# Altium schematic sheet ZMBo Main.SchDoc
size B
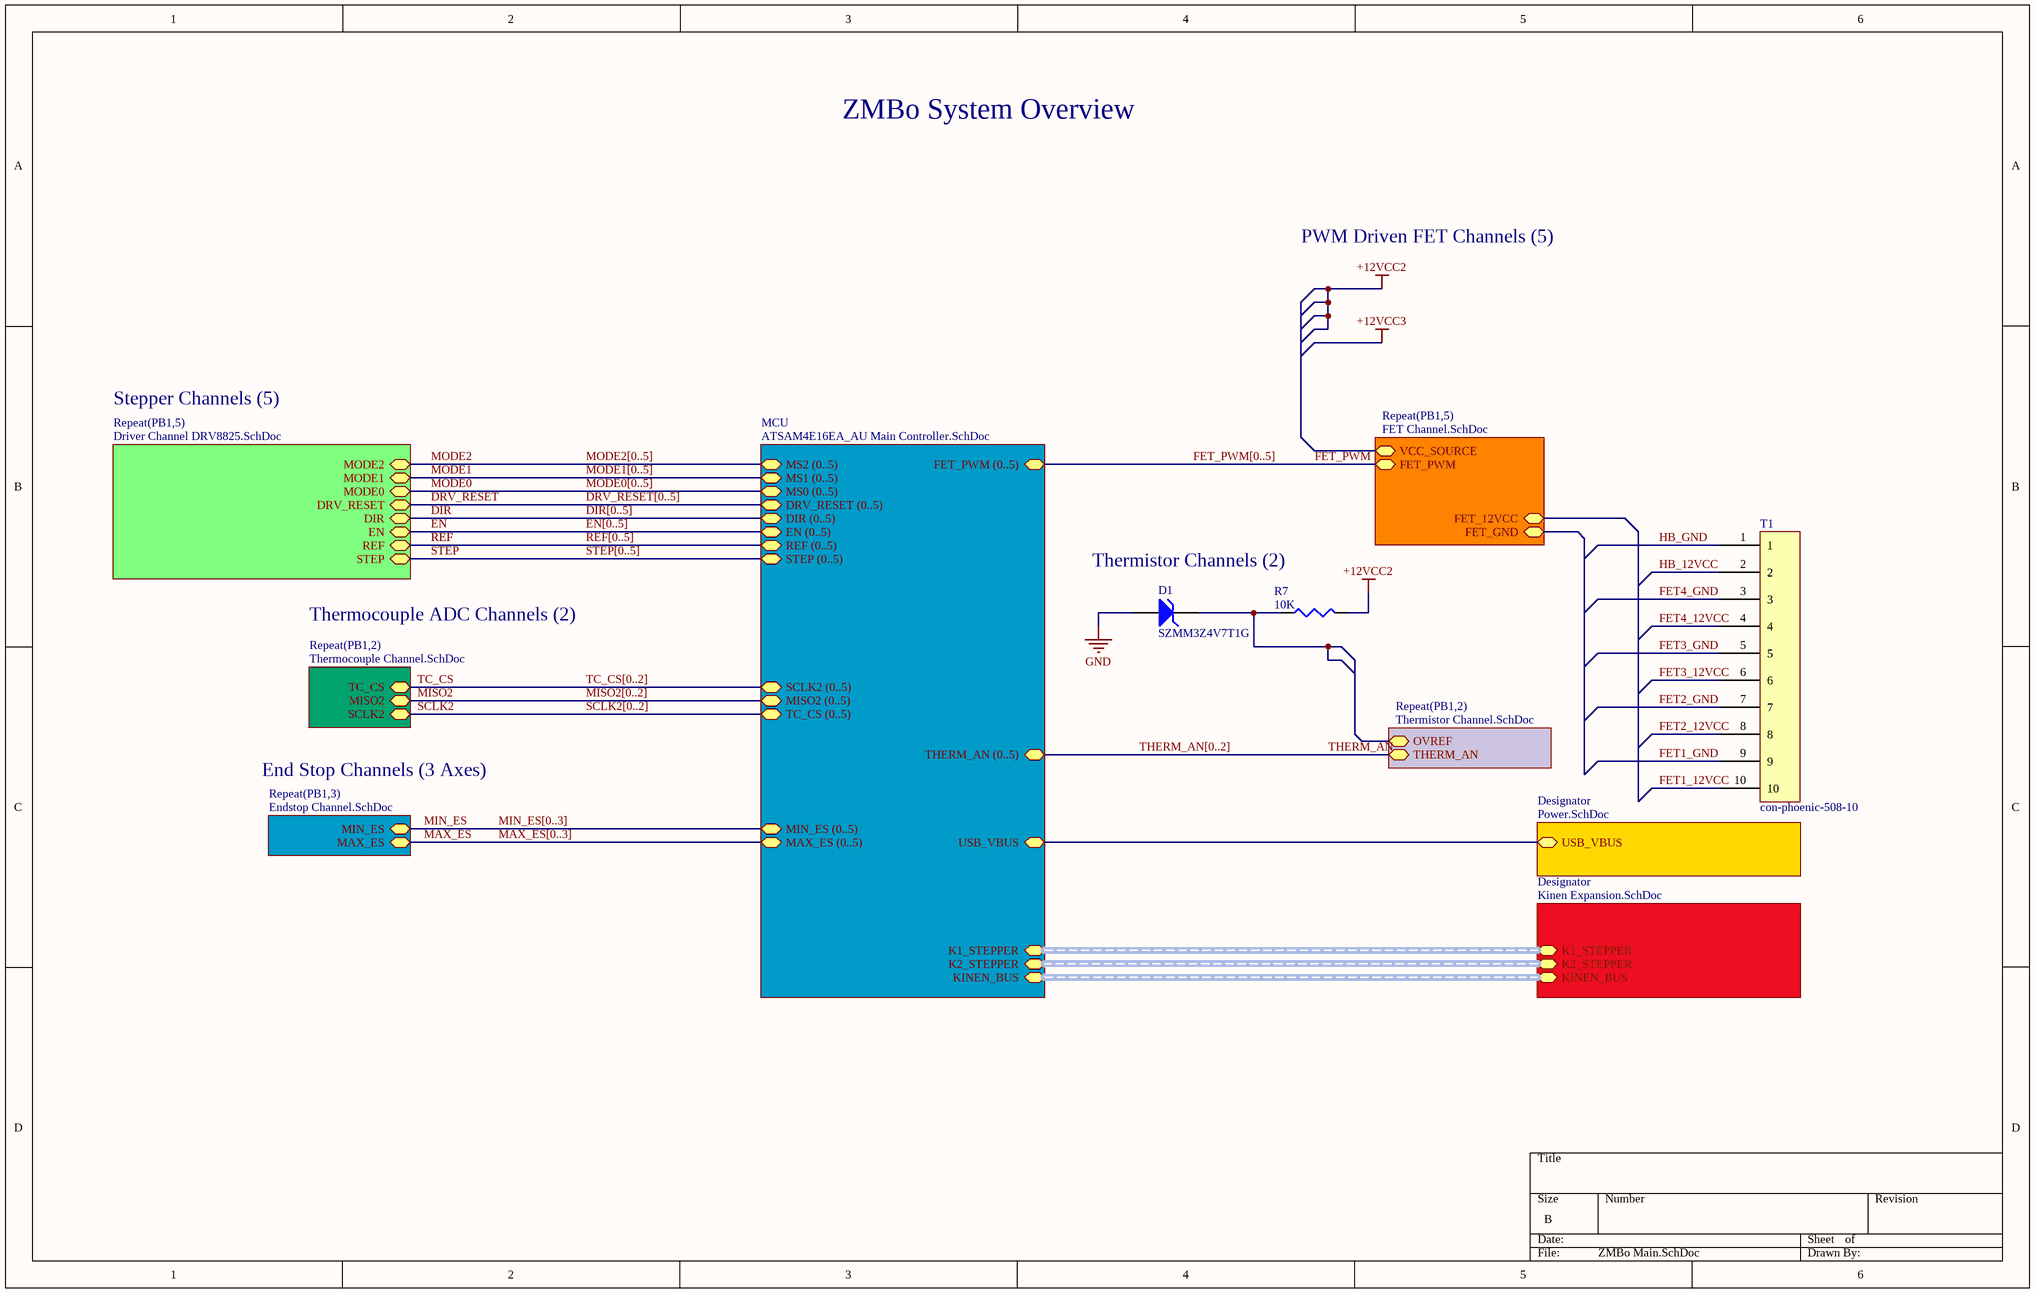
[diagram p0: ZMBo Main.SchDoc]

## Parts
D1  SZMM3Z4V7T1G  [SZMM3Z4V7T1G]
R7  value 10K  [J1-0603]  (hidden comment: Res3)
T1  con-phoenic-508-10  [con-phoenix-508 - 10]

## Sub-sheets
Designator = Power.SchDoc: USB_VBUS (bidir)
Designator = Kinen Expansion.SchDoc: K1_STEPPER (harness K1_STEPPER), K2_STEPPER (harness K2_STEPPER), KINEN_BUS (harness KINEN_BUS)
MCU = ATSAM4E16EA_AU Main Controller.SchDoc: USB_VBUS (bidir), MS1 (0..5), MS0 (0..5), MS2 (0..5), DRV_RESET (0..5), STEP (0..5), REF (0..5), SCLK2 (0..5), MISO2 (0..5), TC_CS (0..5), MAX_ES (0..5), MIN_ES (0..5), THERM_AN (0..5), FET_PWM (0..5), EN (0..5), DIR (0..5), K1_STEPPER (harness K1_STEPPER), K2_STEPPER (harness K2_STEPPER), KINEN_BUS (harness KINEN_BUS)
Repeat(PB1,2) = Thermocouple Channel.SchDoc: SCLK2, MISO2, TC_CS
Repeat(PB1,2) = Thermistor Channel.SchDoc: OVREF, THERM_AN
Repeat(PB1,3) = Endstop Channel.SchDoc: MAX_ES, MIN_ES
Repeat(PB1,5) = FET Channel.SchDoc: FET_PWM, FET_12VCC, FET_GND, VCC_SOURCE
Repeat(PB1,5) = Driver Channel DRV8825.SchDoc: EN, DIR, STEP, REF, DRV_RESET, MODE0, MODE1, MODE2

## Nets
+12VCC2: R7.2
GND: D1.1(A)
DIR: sheet Repeat(PB1,5)/DIR
DRV_RESET: sheet Repeat(PB1,5)/DRV_RESET
EN: sheet Repeat(PB1,5)/EN
FET1_12VCC: T1.10
FET1_GND: T1.9
FET2_12VCC: T1.8
FET2_GND: T1.7
FET3_12VCC: T1.6
FET3_GND: T1.5
FET4_12VCC: T1.4
FET4_GND: T1.3
FET_PWM: sheet Repeat(PB1,5)/FET_PWM
HB_12VCC: T1.2
HB_GND: T1.1
MAX_ES: sheet Repeat(PB1,3)/MAX_ES
MIN_ES: sheet Repeat(PB1,3)/MIN_ES
MISO2: sheet Repeat(PB1,2)/MISO2
MODE0: sheet Repeat(PB1,5)/MODE0
MODE1: sheet Repeat(PB1,5)/MODE1
MODE2: sheet Repeat(PB1,5)/MODE2
REF: sheet Repeat(PB1,5)/REF
SCLK2: sheet Repeat(PB1,2)/SCLK2
STEP: sheet Repeat(PB1,5)/STEP
TC_CS: sheet Repeat(PB1,2)/TC_CS
THERM_AN: sheet Repeat(PB1,2)/THERM_AN
NetD1_2: D1.2(K) R7.1
(unnamed): sheet MCU/USB_VBUS, sheet Designator/USB_VBUS

## Buses and harness runs
bus DIR[0..5] = sheet MCU/DIR (0..5)
bus DRV_RESET[0..5] = sheet MCU/DRV_RESET (0..5)
bus EN[0..5] = sheet MCU/EN (0..5)
bus FET_PWM[0..5] = sheet MCU/FET_PWM (0..5)
bus MAX_ES[0..3] = sheet MCU/MAX_ES (0..5)
bus MIN_ES[0..3] = sheet MCU/MIN_ES (0..5)
bus MISO2[0..2] = sheet MCU/MISO2 (0..5)
bus MODE0[0..5] = sheet MCU/MS0 (0..5)
bus MODE1[0..5] = sheet MCU/MS1 (0..5)
bus MODE2[0..5] = sheet MCU/MS2 (0..5)
bus REF[0..5] = sheet MCU/REF (0..5)
bus SCLK2[0..2] = sheet MCU/TC_CS (0..5)
bus STEP[0..5] = sheet MCU/STEP (0..5)
bus TC_CS[0..2] = sheet MCU/SCLK2 (0..5)
bus THERM_AN[0..2] = sheet MCU/THERM_AN (0..5)
harness sheet Designator/K1_STEPPER = sheet MCU/K1_STEPPER
harness sheet Designator/K2_STEPPER = sheet MCU/K2_STEPPER
harness sheet Designator/KINEN_BUS = sheet MCU/KINEN_BUS

## Notes on the sheet
- ZMBo System Overview
- PWM Driven FET Channels (5)
- Stepper Channels (5)
- Thermistor Channels (2)
- Thermocouple ADC Channels (2)
- End Stop Channels (3 Axes)

## Library data of the parts
D1 = D Zener: Zener Diode; Published: 8-Jun-2000; LatestRevisionDate: 17-Jul-2002; LatestRevisionNote: Re-released for DXP Platform.; PackageReference: DIODE-0.7; Publisher: Altium Limited; PackageDescription: Diode, Thru-Hole; 2 Leads; 0.7 in Pin Spacing
R7 = Res3: Resistor; Published: 8-Jun-2000; LatestRevisionDate: 29-May-2009; LatestRevisionNote: IPC-7351 Footprint Added.; PackageReference: J1-0603; Publisher: Altium Limited; PackageDescription: Chip Resistor